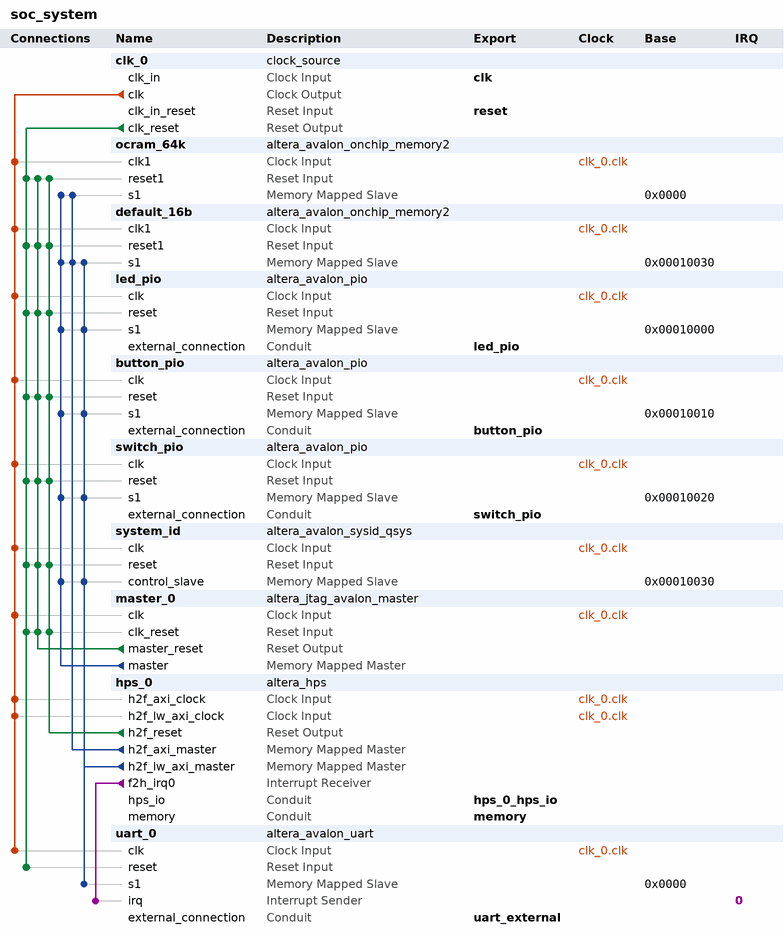
[diagram p0: system contents]
# Platform Designer (Qsys) system soc_system, Cyclone V 5CSEBA6U23I7
# Parameters at their usual value, and those the tool derives, are not listed.
package require -exact qsys 16.1
create_system soc_system
set_project_property DEVICE_FAMILY {Cyclone V}
set_project_property DEVICE 5CSEBA6U23I7

add_instance clk_0 clock_source 16.1
set_instance_parameter_value clk_0 clockFrequency 50000000

add_instance ocram_64k altera_avalon_onchip_memory2 16.1
set_instance_parameter_value ocram_64k dataWidth 64
set_instance_parameter_value ocram_64k dualPort false
set_instance_parameter_value ocram_64k initMemContent true
set_instance_parameter_value ocram_64k initializationFileName onchip_mem.hex
set_instance_parameter_value ocram_64k memorySize 65536

add_instance default_16b altera_avalon_onchip_memory2 16.1
set_instance_parameter_value default_16b dataWidth 32
set_instance_parameter_value default_16b dualPort false
set_instance_parameter_value default_16b initMemContent true
set_instance_parameter_value default_16b initializationFileName onchip_mem.hex
set_instance_parameter_value default_16b memorySize 16

add_instance led_pio altera_avalon_pio 16.1
set_instance_parameter_value led_pio direction Output
set_instance_parameter_value led_pio width 8

add_instance button_pio altera_avalon_pio 16.1
set_instance_parameter_value button_pio direction Input
set_instance_parameter_value button_pio width 1

add_instance switch_pio altera_avalon_pio 16.1
set_instance_parameter_value switch_pio direction Input
set_instance_parameter_value switch_pio width 4

add_instance system_id altera_avalon_sysid_qsys 16.1
set_instance_parameter_value system_id id -569319920

add_instance master_0 altera_jtag_avalon_master 16.1

add_instance hps_0 altera_hps 16.1
set_instance_parameter_value hps_0 EMAC1_Mode RGMII
set_instance_parameter_value hps_0 EMAC1_PinMuxing {HPS I/O Set 0}
set_instance_parameter_value hps_0 F2SCLK_COLDRST_Enable false
set_instance_parameter_value hps_0 F2SCLK_DBGRST_Enable false
set_instance_parameter_value hps_0 F2SCLK_WARMRST_Enable false
set_instance_parameter_value hps_0 F2SINTERRUPT_Enable true
set_instance_parameter_value hps_0 F2S_Width 0
set_instance_parameter_value hps_0 FPGA_PERIPHERAL_OUTPUT_CLOCK_FREQ_EMAC0_GTX_CLK 125
set_instance_parameter_value hps_0 FPGA_PERIPHERAL_OUTPUT_CLOCK_FREQ_EMAC0_MD_CLK 2.5
set_instance_parameter_value hps_0 FPGA_PERIPHERAL_OUTPUT_CLOCK_FREQ_EMAC1_GTX_CLK 125
set_instance_parameter_value hps_0 FPGA_PERIPHERAL_OUTPUT_CLOCK_FREQ_EMAC1_MD_CLK 2.5
set_instance_parameter_value hps_0 HPS_PROTOCOL DDR3
set_instance_parameter_value hps_0 I2C0_Mode I2C
set_instance_parameter_value hps_0 I2C0_PinMuxing {HPS I/O Set 0}
set_instance_parameter_value hps_0 I2C1_Mode I2C
set_instance_parameter_value hps_0 I2C1_PinMuxing {HPS I/O Set 0}
set_instance_parameter_value hps_0 LWH2F_Enable true
set_instance_parameter_value hps_0 MEM_BANKADDR_WIDTH 3
set_instance_parameter_value hps_0 MEM_CLK_FREQ 400.0
set_instance_parameter_value hps_0 MEM_COL_ADDR_WIDTH 10
set_instance_parameter_value hps_0 MEM_DQ_WIDTH 32
set_instance_parameter_value hps_0 MEM_DRV_STR RZQ/6
set_instance_parameter_value hps_0 MEM_ROW_ADDR_WIDTH 15
set_instance_parameter_value hps_0 MEM_RTT_NOM RZQ/6
set_instance_parameter_value hps_0 MEM_RTT_WR {Dynamic ODT off}
set_instance_parameter_value hps_0 MEM_TCL 7
set_instance_parameter_value hps_0 MEM_TFAW_NS 37.5
set_instance_parameter_value hps_0 MEM_TRAS_NS 35.0
set_instance_parameter_value hps_0 MEM_TRCD_NS 13.75
set_instance_parameter_value hps_0 MEM_TRFC_NS 300.0
set_instance_parameter_value hps_0 MEM_TRP_NS 13.75
set_instance_parameter_value hps_0 MEM_VENDOR Other
set_instance_parameter_value hps_0 MEM_WTCL 7
set_instance_parameter_value hps_0 QSPI_Mode N/A
set_instance_parameter_value hps_0 QSPI_PinMuxing Unused
set_instance_parameter_value hps_0 REF_CLK_FREQ 25.0
set_instance_parameter_value hps_0 S2FCLK_USER2CLK 5
set_instance_parameter_value hps_0 S2F_Width 2
set_instance_parameter_value hps_0 SDIO_Mode {4-bit Data}
set_instance_parameter_value hps_0 SDIO_PinMuxing {HPS I/O Set 0}
set_instance_parameter_value hps_0 SPIM1_Mode {Single Slave Select}
set_instance_parameter_value hps_0 SPIM1_PinMuxing {HPS I/O Set 0}
set_instance_parameter_value hps_0 STM_Enable false
set_instance_parameter_value hps_0 TIMING_BOARD_AC_SKEW 0.02
set_instance_parameter_value hps_0 TIMING_BOARD_AC_TO_CK_SKEW 0.0
set_instance_parameter_value hps_0 TIMING_BOARD_DQ_TO_DQS_SKEW 0.0
set_instance_parameter_value hps_0 TIMING_BOARD_MAX_CK_DELAY 0.6
set_instance_parameter_value hps_0 TIMING_BOARD_MAX_DQS_DELAY 0.6
set_instance_parameter_value hps_0 TIMING_BOARD_SKEW_BETWEEN_DQS 0.02
set_instance_parameter_value hps_0 TIMING_BOARD_SKEW_CKDQS_DIMM_MAX 0.01
set_instance_parameter_value hps_0 TIMING_BOARD_SKEW_CKDQS_DIMM_MIN -0.01
set_instance_parameter_value hps_0 TIMING_BOARD_SKEW_WITHIN_DQS 0.02
set_instance_parameter_value hps_0 TIMING_TDH 125
set_instance_parameter_value hps_0 TIMING_TDQSCK 400
set_instance_parameter_value hps_0 TIMING_TDQSQ 120
set_instance_parameter_value hps_0 TIMING_TDS 50
set_instance_parameter_value hps_0 TIMING_TIH 250
set_instance_parameter_value hps_0 TIMING_TIS 175
set_instance_parameter_value hps_0 TIMING_TQSH 0.38
set_instance_parameter_value hps_0 UART0_Mode {No Flow Control}
set_instance_parameter_value hps_0 UART0_PinMuxing {HPS I/O Set 0}
set_instance_parameter_value hps_0 USB1_Mode SDR
set_instance_parameter_value hps_0 USB1_PinMuxing {HPS I/O Set 0}
set_instance_parameter_value hps_0 desired_cfg_clk_mhz 100.0
set_instance_parameter_value hps_0 desired_qspi_clk_mhz 400.0

add_instance uart_0 altera_avalon_uart 16.1
set_instance_parameter_value uart_0 baud 38400
set_instance_parameter_value uart_0 dataBits 8
set_instance_parameter_value uart_0 fixedBaud true
set_instance_parameter_value uart_0 parity NONE
set_instance_parameter_value uart_0 stopBits 1

# connections
add_connection clk_0.clk button_pio.clk clock
add_connection clk_0.clk default_16b.clk1 clock
add_connection clk_0.clk hps_0.h2f_axi_clock clock
add_connection clk_0.clk hps_0.h2f_lw_axi_clock clock
add_connection clk_0.clk led_pio.clk clock
add_connection clk_0.clk master_0.clk clock
add_connection clk_0.clk ocram_64k.clk1 clock
add_connection clk_0.clk switch_pio.clk clock
add_connection clk_0.clk system_id.clk clock
add_connection clk_0.clk uart_0.clk clock
add_connection clk_0.clk_reset button_pio.reset reset
add_connection clk_0.clk_reset default_16b.reset1 reset
add_connection clk_0.clk_reset led_pio.reset reset
add_connection clk_0.clk_reset master_0.clk_reset reset
add_connection clk_0.clk_reset ocram_64k.reset1 reset
add_connection clk_0.clk_reset switch_pio.reset reset
add_connection clk_0.clk_reset system_id.reset reset
add_connection clk_0.clk_reset uart_0.reset reset
add_connection hps_0.h2f_reset button_pio.reset reset
add_connection hps_0.h2f_reset default_16b.reset1 reset
add_connection hps_0.h2f_reset led_pio.reset reset
add_connection hps_0.h2f_reset master_0.clk_reset reset
add_connection hps_0.h2f_reset ocram_64k.reset1 reset
add_connection hps_0.h2f_reset switch_pio.reset reset
add_connection hps_0.h2f_reset system_id.reset reset
add_connection master_0.master_reset button_pio.reset reset
add_connection master_0.master_reset default_16b.reset1 reset
add_connection master_0.master_reset led_pio.reset reset
add_connection master_0.master_reset master_0.clk_reset reset
add_connection master_0.master_reset ocram_64k.reset1 reset
add_connection master_0.master_reset switch_pio.reset reset
add_connection master_0.master_reset system_id.reset reset
add_connection hps_0.h2f_axi_master default_16b.s1 avalon
set_connection_parameter_value hps_0.h2f_axi_master/default_16b.s1 baseAddress 0x00010030
set_connection_parameter_value hps_0.h2f_axi_master/default_16b.s1 defaultConnection true
add_connection hps_0.h2f_axi_master ocram_64k.s1 avalon
set_connection_parameter_value hps_0.h2f_axi_master/ocram_64k.s1 baseAddress 0x0000
add_connection hps_0.h2f_lw_axi_master button_pio.s1 avalon
set_connection_parameter_value hps_0.h2f_lw_axi_master/button_pio.s1 baseAddress 0x00010010
add_connection hps_0.h2f_lw_axi_master default_16b.s1 avalon
set_connection_parameter_value hps_0.h2f_lw_axi_master/default_16b.s1 baseAddress 0x00010030
set_connection_parameter_value hps_0.h2f_lw_axi_master/default_16b.s1 defaultConnection true
add_connection hps_0.h2f_lw_axi_master led_pio.s1 avalon
set_connection_parameter_value hps_0.h2f_lw_axi_master/led_pio.s1 baseAddress 0x00010000
add_connection hps_0.h2f_lw_axi_master switch_pio.s1 avalon
set_connection_parameter_value hps_0.h2f_lw_axi_master/switch_pio.s1 baseAddress 0x00010020
add_connection hps_0.h2f_lw_axi_master system_id.control_slave avalon
set_connection_parameter_value hps_0.h2f_lw_axi_master/system_id.control_slave baseAddress 0x00010030
add_connection hps_0.h2f_lw_axi_master uart_0.s1 avalon
set_connection_parameter_value hps_0.h2f_lw_axi_master/uart_0.s1 baseAddress 0x0000
add_connection master_0.master button_pio.s1 avalon
set_connection_parameter_value master_0.master/button_pio.s1 baseAddress 0x00010010
add_connection master_0.master default_16b.s1 avalon
set_connection_parameter_value master_0.master/default_16b.s1 baseAddress 0x00010030
set_connection_parameter_value master_0.master/default_16b.s1 defaultConnection true
add_connection master_0.master led_pio.s1 avalon
set_connection_parameter_value master_0.master/led_pio.s1 baseAddress 0x00010000
add_connection master_0.master ocram_64k.s1 avalon
set_connection_parameter_value master_0.master/ocram_64k.s1 baseAddress 0x0000
add_connection master_0.master switch_pio.s1 avalon
set_connection_parameter_value master_0.master/switch_pio.s1 baseAddress 0x00010020
add_connection master_0.master system_id.control_slave avalon
set_connection_parameter_value master_0.master/system_id.control_slave baseAddress 0x00010030
add_connection hps_0.f2h_irq0 uart_0.irq interrupt
set_connection_parameter_value hps_0.f2h_irq0/uart_0.irq irqNumber 0

# exported interfaces
add_interface button_pio conduit end
set_interface_property button_pio EXPORT_OF button_pio.external_connection
add_interface clk clock sink
set_interface_property clk EXPORT_OF clk_0.clk_in
add_interface hps_0_hps_io conduit end
set_interface_property hps_0_hps_io EXPORT_OF hps_0.hps_io
add_interface led_pio conduit end
set_interface_property led_pio EXPORT_OF led_pio.external_connection
add_interface memory conduit end
set_interface_property memory EXPORT_OF hps_0.memory
add_interface reset reset sink
set_interface_property reset EXPORT_OF clk_0.clk_in_reset
add_interface switch_pio conduit end
set_interface_property switch_pio EXPORT_OF switch_pio.external_connection
add_interface uart_external conduit end
set_interface_property uart_external EXPORT_OF uart_0.external_connection

set_interconnect_requirement {$system} qsys_mm.clockCrossingAdapter HANDSHAKE
set_interconnect_requirement {$system} qsys_mm.enableEccProtection FALSE
set_interconnect_requirement {$system} qsys_mm.insertDefaultSlave FALSE
set_interconnect_requirement {$system} qsys_mm.maxAdditionalLatency 1

save_system soc_system.qsys
